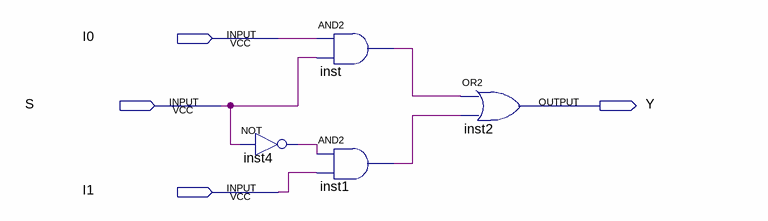
[diagram p0: schematic sheet]
// Quartus schematic Mux2_1.bdf as structural Verilog: 4 symbols, 4 pins
module Mux2_1 (
  input  I0,
  input  S,
  input  I1,
  output Y
);

  wire inst1_out, inst4_out, inst_out;

  not inst4 (inst4_out, S);
  and inst (inst_out, I0, S);
  and inst1 (inst1_out, inst4_out, I1);
  or inst2 (Y, inst_out, inst1_out);
endmodule
